# Altium schematic sheet 780-00012-P0, Sch M2 Focus Drive.SchDoc
size B
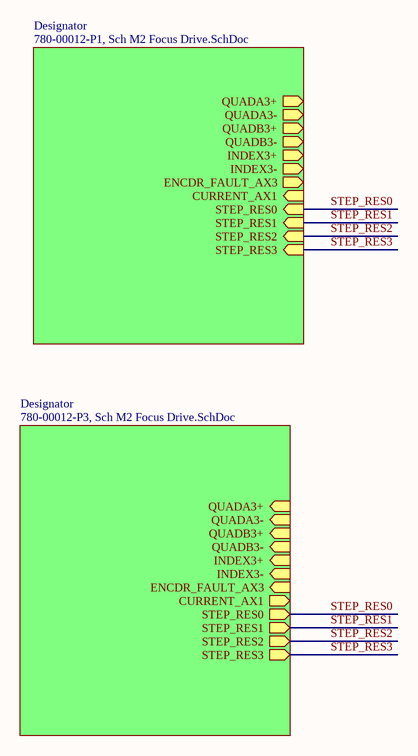
[diagram p0: 780-00012-P0, Sch M2 Focus Drive.SchDoc]

## Sub-sheets
Designator = 780-00012-P1, Sch M2 Focus Drive.SchDoc: QUADA3+ (out), QUADA3- (out), QUADB3+ (out), QUADB3- (out), INDEX3+ (out), INDEX3- (out), ENCDR_FAULT_AX3 (out), CURRENT_AX1 (in), STEP_RES0 (in), STEP_RES1 (in), STEP_RES2 (in), STEP_RES3 (in)
Designator = 780-00012-P3, Sch M2 Focus Drive.SchDoc: QUADA3+ (in), QUADA3- (in), QUADB3+ (in), QUADB3- (in), INDEX3+ (in), INDEX3- (in), ENCDR_FAULT_AX3 (in), CURRENT_AX1 (out), STEP_RES0 (out), STEP_RES1 (out), STEP_RES2 (out), STEP_RES3 (out)

## Nets
STEP_RES0: sheet Designator/STEP_RES0, sheet Designator/STEP_RES0
STEP_RES1: sheet Designator/STEP_RES1, sheet Designator/STEP_RES1
STEP_RES2: sheet Designator/STEP_RES2, sheet Designator/STEP_RES2
STEP_RES3: sheet Designator/STEP_RES3, sheet Designator/STEP_RES3